# EAGLE design esp32 (EAGLE 7.5.0)
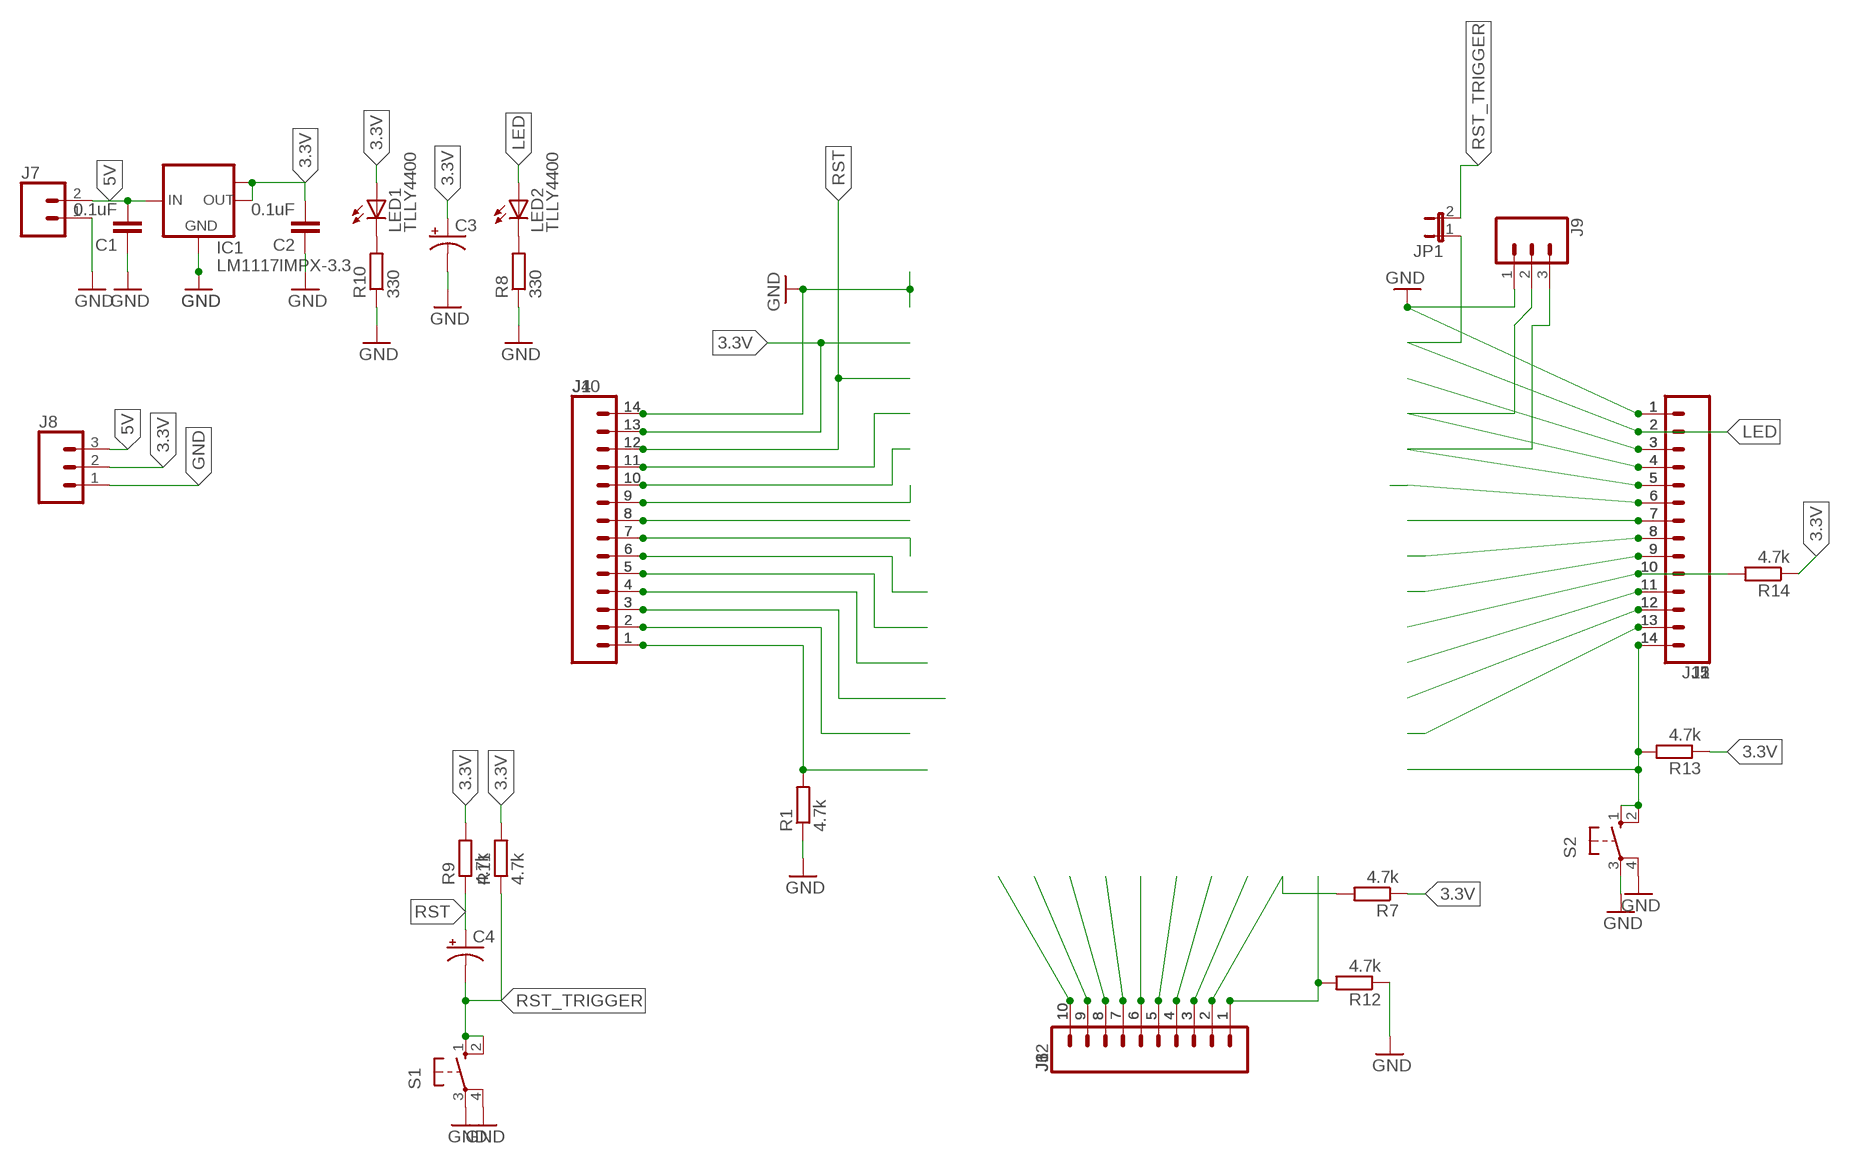
[diagram p0: schematic, sheet 1]

## Parts
C1  0.1uF  0.1UF-KIT-EZ-50V-20%  [CAP-PTH-SMALL-KIT]
C2  0.1uF  0.1UF-KIT-EZ-50V-20%  [CAP-PTH-SMALL-KIT]
C3  CPOL-USE3.5-8  [E3,5-8]
C4  CPOL-USE3.5-8  [E3,5-8]
IC1  LM1117IMPX-3.3  [SOT223]
J1  CONN_14LONGPADS  [1X14-LONGPADS]
J2  CONN_14LONGPADS  [1X14-LONGPADS]
J3  CONN_10"  [1X10]
J4  CONN_14LONGPADS  [1X14-LONGPADS]
J5  CONN_14LONGPADS  [1X14-LONGPADS]
J6  CONN_10"  [1X10]
J7  CONN_023.5MM  [SCREWTERMINAL-3.5MM-2]
J8  CONN_03  [1X03]
J9  CONN_03  [1X03]
J10  CONN_14LONGPADS  [1X14-LONGPADS]
J11  CONN_14LONGPADS  [1X14-LONGPADS]
J12  CONN_10"  [1X10]
JP1  JP1E  [JP1]
LED1  TLLY4400  [LED3MM]
LED2  TLLY4400  [LED3MM]
R1  4.7k  R-EU_0207/12  [0207/12]
R7  4.7k  R-EU_0207/12  [0207/12]
R8  330  R-EU_0207/12  [0207/12]
R9  4.7k  R-EU_0207/12  [0207/12]
R10  330  R-EU_0207/12  [0207/12]
R11  4.7k  R-EU_0207/12  [0207/12]
R12  4.7k  R-EU_0207/12  [0207/12]
R13  4.7k  R-EU_0207/12  [0207/12]
R14  4.7k  R-EU_0207/12  [0207/12]
S1  10-XX  [B3F-10XX]
S2  10-XX  [B3F-10XX]

## Nets
3.3V: C2.2 C3.+ IC1.2(OUT) IC1.TAB(OUT1) J1.13 J4.13 J8.2 J10.13 LED1.A R7.1 R9.2 R11.2 R13.1 R14.1
5V: C1.2 IC1.3(IN) J7.2 J8.3
GND: C1.1 C2.1 C3.- IC1.1(GND) J1.14 J2.1 J3.10 J4.14 J5.1 J6.10 J7.1 J8.1 J9.1 J10.14 J11.1 J12.10 R1.1 R8.1 R10.1 R12.1 S1.3(P) S1.4(P1) S2.3(P) S2.4(P1)
LED: J2.2 J5.2 J11.2 JP1.1 LED2.A
N$1: J2.7 J5.7 J11.7
N$2: J1.11 J4.11 J10.11
N$3: J1.10 J4.10 J10.10
N$4: LED1.K(C) R10.2
N$5: LED2.K(C) R8.2
N$6: J1.9 J4.9 J10.9
N$7: J1.8 J4.8 J10.8
N$8: J1.7 J4.7 J10.7
N$9: J1.6 J4.6 J10.6
N$10: J1.5 J4.5 J10.5
N$11: J1.4 J4.4 J10.4
N$12: J1.3 J4.3 J10.3
N$13: J1.2 J4.2 J10.2
N$14: J1.1 J4.1 J10.1 R1.2
N$15: J2.5 J5.5 J9.3 J11.5
N$16: J2.4 J5.4 J9.2 J11.4
N$17: J2.3 J5.3 J11.3
N$19: J2.10 J5.10 J11.10 R14.2
N$20: J2.6 J5.6 J11.6
N$22: J2.8 J5.8 J11.8
N$23: J2.9 J5.9 J11.9
N$25: J2.11 J5.11 J11.11
N$26: J2.12 J5.12 J11.12
N$27: J2.13 J5.13 J11.13
N$28: J2.14 J5.14 J11.14 R13.2 S2.1(S) S2.2(S1)
N$30: J3.9 J6.9 J12.9
N$31: J3.8 J6.8 J12.8
N$32: J3.7 J6.7 J12.7
N$33: J3.6 J6.6 J12.6
N$34: J3.5 J6.5 J12.5
N$35: J3.4 J6.4 J12.4
N$36: J3.3 J6.3 J12.3
N$37: J3.2 J6.2 J12.2 R7.2
N$38: J3.1 J6.1 J12.1 R12.2
RST: C4.+ J1.12 J4.12 J10.12 R9.1
RST_TRIGGER: C4.- JP1.2 R11.1 S1.1(S) S1.2(S1)

## Library data of the parts
C1 C2 = SparkFun-Capacitors:0.1UF: 0.1µF ceramic capacitors A capacitor is a passive two-terminal electrical component used to store electrical energy temporarily in an electric field.; PROD_ID: CAP-08370
C3 C4 = rcl:CPOL-US: POLARIZED CAPACITOR, American symbol
IC1 = lm1117:LM1117IMPX-*
J1 J2 J4 J5 J10 J11 = SparkFun-Connectors:CONN_14: Multi connection point. Often used as Generic Header-pin footprint for 0.1 inch spaced/style header connections On any of the 0.1 inch spaced packages, you can populate with these: Break Away Headers - Straight <https://www.sparkfun.com/products/116> (PRT-00116) Break Away Male Headers - Right Angle <https://www.sparkfun.com/products/553> (PRT-00553) Female Headers <https://www.sparkfun.com/products/115> (PRT-00115) Break Away Headers - Machine Pin <https://www.sparkfun.com/products/117> (PRT-00117) Break Away Female Headers - Swiss Machine Pin <https://www.sparkfun.com/products/743> (PRT-00743) For SCREWTERMINALS and SPRING TERMINALS visit here: Screw Terimnals on SparkFun.com <https://www.sparkfun.com/search/results?term=Screw+Terminals> (5mm/3.5mm/2.54mm spacing) This device is also useful as a general connection point to wire up your design to another part of your project. Our various solder wires solder well into these plated through hole pads. Hook-Up Wire - Assortment (Stranded, 22 AWG) <https://www.sparkfun.com/products/11375> (PRT-11375) Hook-Up Wire - Assortment (Solid Core, 22 AWG) <https://www.sparkfun.com/products/11367> (PRT-11367) View the entire wire category on our website here <https://www.sparkfun.com/categories/141> Special notes: Molex polarized connector foot print use with SKU : PRT-08231 with associated crimp pins and housings. 1MM SMD Version SKU: PRT-10208 NOTES ON THE VARIANTS LOCK and LOCK_LONGPADS... This footprint was designed to help hold the alignment of a through-hole component (i.e. 6-pin header) while soldering it into place. You may notice that each hole has been shifted either up or down by 0.005 of an inch from it's more standard position (which is a perfectly straight line). This slight alteration caused the pins (the squares in the middle) to touch the edges of the holes. Because they are alternating, it causes a "brace" to hold the component in place. 0.005 has proven to be the perfect amount of "off-center" position when using our standard breakaway headers. Although looks a little odd when you look at the bare footprint, once you have a header in there, the alteration is very hard to notice. Also,if you push a header all the way into place, it is covered up entirely on the bottom side.
J3 J6 J12 = SparkFun-Connectors:CONN_10: Multi connection point. Often used as Generic Header-pin footprint for 0.1 inch spaced/style header connections On any of the 0.1 inch spaced packages, you can populate with these: Break Away Headers - Straight <https://www.sparkfun.com/products/116> (PRT-00116) Break Away Male Headers - Right Angle <https://www.sparkfun.com/products/553> (PRT-00553) Female Headers <https://www.sparkfun.com/products/115> (PRT-00115) Break Away Headers - Machine Pin <https://www.sparkfun.com/products/117> (PRT-00117) Break Away Female Headers - Swiss Machine Pin <https://www.sparkfun.com/products/743> (PRT-00743) Arduino Stackable Header - 10 Pin <https://www.sparkfun.com/products/11376> (PRT-11376) For SCREWTERMINALS and SPRING TERMINALS visit here: Screw Terimnals on SparkFun.com <https://www.sparkfun.com/search/results?term=Screw+Terminals> (5mm/3.5mm/2.54mm spacing) This device is also useful as a general connection point to wire up your design to another part of your project. Our various solder wires solder well into these plated through hole pads. Hook-Up Wire - Assortment (Stranded, 22 AWG) <https://www.sparkfun.com/products/11375> (PRT-11375) Hook-Up Wire - Assortment (Solid Core, 22 AWG) <https://www.sparkfun.com/products/11367> (PRT-11367) View the entire wire category on our website here <https://www.sparkfun.com/categories/141> Special notes: Molex polarized connector foot print use with SKU : PRT-08231 with associated crimp pins and housings. 1MM SMD Version SKU: PRT-10208 NOTES ON THE VARIANTS LOCK and LOCK_LONGPADS... This footprint was designed to help hold the alignment of a through-hole component (i.e. 6-pin header) while soldering it into place. You may notice that each hole has been shifted either up or down by 0.005 of an inch from it's more standard position (which is a perfectly straight line). This slight alteration caused the pins (the squares in the middle) to touch the edges of the holes. Because they are alternating, it causes a "brace" to hold the component in place. 0.005 has proven to be the perfect amount of "off-center" position when using our standard breakaway headers. Although looks a little odd when you look at the bare footprint, once you have a header in there, the alteration is very hard to notice. Also,if you push a header all the way into place, it is covered up entirely on the bottom side.; PROD_ID: CONN-11563
J7 = SparkFun-Connectors:CONN_02: Multi connection point. Often used as Generic Header-pin footprint for 0.1 inch spaced/style header connections On any of the 0.1 inch spaced packages, you can populate with these: Break Away Headers - Straight <https://www.sparkfun.com/products/116> (PRT-00116) Break Away Male Headers - Right Angle <https://www.sparkfun.com/products/553> (PRT-00553) Female Headers <https://www.sparkfun.com/products/115> (PRT-00115) Break Away Headers - Machine Pin <https://www.sparkfun.com/products/117> (PRT-00117) Break Away Female Headers - Swiss Machine Pin <https://www.sparkfun.com/products/743> (PRT-00743) For SCREWTERMINALS and SPRING TERMINALS visit here: Screw Terimnals on SparkFun.com <https://www.sparkfun.com/search/results?term=Screw+Terminals> (5mm/3.5mm/2.54mm spacing) This device is also useful as a general connection point to wire up your design to another part of your project. Our various solder wires solder well into these plated through hole pads. Hook-Up Wire - Assortment (Stranded, 22 AWG) <https://www.sparkfun.com/products/11375> (PRT-11375) Hook-Up Wire - Assortment (Solid Core, 22 AWG) <https://www.sparkfun.com/products/11367> (PRT-11367) View the entire wire category on our website here <https://www.sparkfun.com/categories/141> Special notes: Molex polarized connector foot print use with: PRT-08233 with associated crimp pins and housings. 2.54_SCREWTERM for use with PRT-10571. 3.5mm Screw Terminal footprints for PRT-08084 5mm Screw Terminal footprints for use with PRT-08432; PROD_ID: CONN-08399
J8 J9 = SparkFun-Connectors:CONN_03: Multi connection point. Often used as Generic Header-pin footprint for 0.1 inch spaced/style header connections On any of the 0.1 inch spaced packages, you can populate with these: Break Away Headers - Straight <https://www.sparkfun.com/products/116> (PRT-00116) Break Away Male Headers - Right Angle <https://www.sparkfun.com/products/553> (PRT-00553) Female Headers <https://www.sparkfun.com/products/115> (PRT-00115) Break Away Headers - Machine Pin <https://www.sparkfun.com/products/117> (PRT-00117) Break Away Female Headers - Swiss Machine Pin <https://www.sparkfun.com/products/743> (PRT-00743) Stackable Header - 3 Pin (Female, 0.1") <https://www.sparkfun.com/products/13875> (PRT-13875) For SCREWTERMINALS and SPRING TERMINALS visit here: Screw Terimnals on SparkFun.com <https://www.sparkfun.com/search/results?term=Screw+Terminals> (5mm/3.5mm/2.54mm spacing) This device is also useful as a general connection point to wire up your design to another part of your project. Our various solder wires solder well into these plated through hole pads. Hook-Up Wire - Assortment (Stranded, 22 AWG) <https://www.sparkfun.com/products/11375> (PRT-11375) Hook-Up Wire - Assortment (Solid Core, 22 AWG) <https://www.sparkfun.com/products/11367> (PRT-11367) View the entire wire category on our website here <https://www.sparkfun.com/categories/141> Special notes: Molex polarized connector foot print use with SKU : PRT-08232 with associated crimp pins and housings.
JP1 = jumper:JP1E: JUMPER
LED1 LED2 = led:TLLY4400: Low Current (2mA) LED 3 mm Tinted Diffused Package color YELLOW Source: Data sheet <http://www.farnell.com/datasheets/391098.pdf>; MF: VISHAY SEMICONDUCTOR; OC_FARNELL: 1612439
R1 R7-R14 = rcl:R-EU_: RESISTOR, European symbol
S1 S2 = switch-omron:10-XX: OMRON SWITCH; MPN: B3F-1000; OC_FARNELL: 176432; OC_NEWARK: 36M3542

## Board
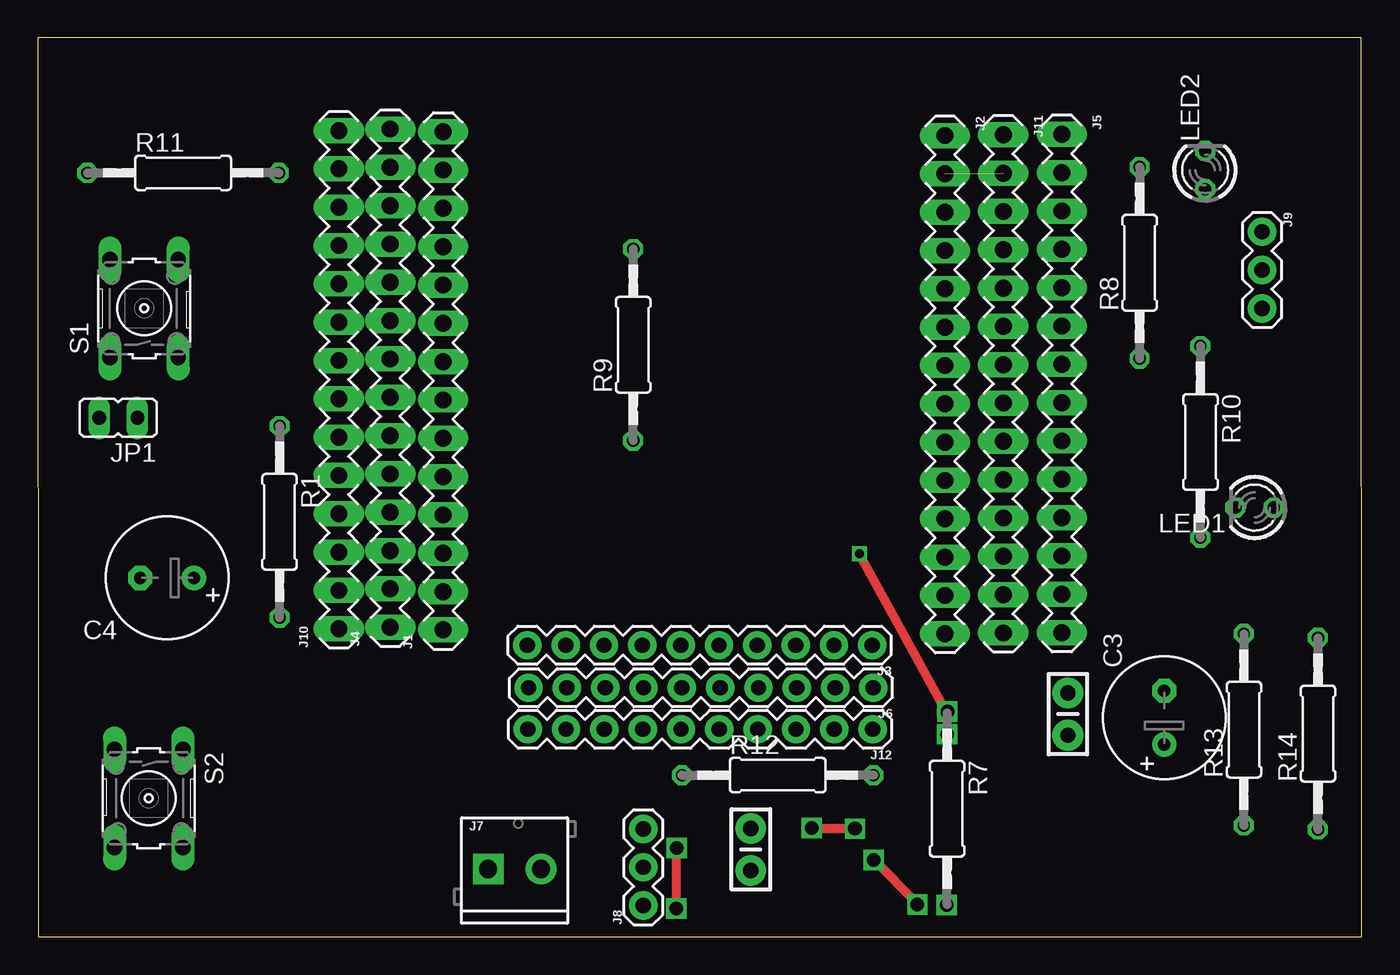
[diagram p1: board, top side]
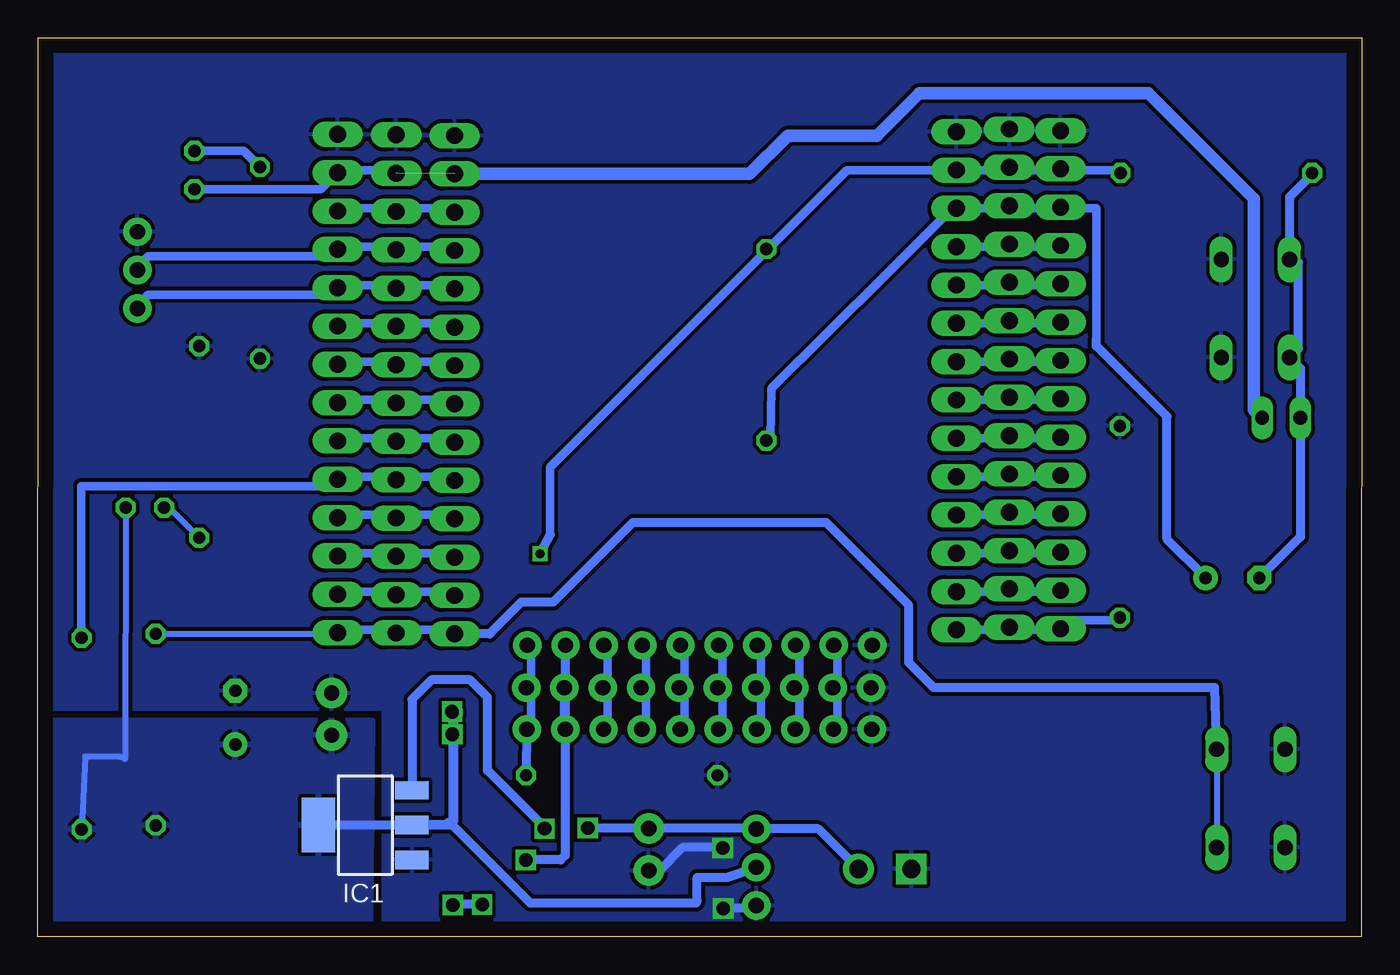
[diagram p2: board, bottom side, seen from below]

Size 87.79 x 59.6 mm. Coordinates in mm from the lower left corner, seen from the top.
Outline: 0.03,0 87.79,0 87.76,59.6 0,59.6 0.03,0
Copper layers (1*16): Top 0.035mm / dielectric 1.5mm / Bottom 0.035mm
Design rules "default *": minimum track width 22mil, minimum drill 24mil, track to track 10mil, track to pad 10mil, pad to pad 10mil, via to via 10mil, smd to smd 10mil, copper to edge 40mil, drill to drill 8mil, minimum pad ring 10mil, minimum via ring 8mil, stop-mask expansion 4mil, vias tented up to drill 0mil, thermal gap 10mil

### Footprints (pad centres in the part's own frame; a part is rotated, then mirrored left to right if it is on the bottom)
CAP-PTH-SMALL-KIT = drill 1.016 pad 2.032: 1 -1.397,0; 2 1.397,0
E3,5-8 = drill 0.813 pad 1.6: + -1.778,0 | drill 0.813 pad 1.6 octagon: - 1.778,0
SOT223 = smd 1.219 x 2.235: 1 -2.311,-3.099; 2 0,-3.099; 3 2.311,-3.099 | smd 3.6 x 2.2: TAB 0,3.099
1X14-LONGPADS = drill 1.118 long: 1 0,0; 2 2.54,0; 3 5.08,0; 4 7.62,0; 5 10.16,0; 6 12.7,0; 7 15.24,0; 8 17.78,0; 9 20.32,0; 10 22.86,0; 11 25.4,0; 12 27.94,0; 13 30.48,0; 14 33.02,0
1X10 = drill 1.016 pad 1.88: 1 0,0; 2 2.54,0; 3 5.08,0; 4 7.62,0; 5 10.16,0; 6 12.7,0; 7 15.24,0; 8 17.78,0; 9 20.32,0; 10 22.86,0
SCREWTERMINAL-3.5MM-2 = drill 1.2 pad 2.032 square: 1 0,0 | drill 1.2 pad 2.032: 2 3.5,0
1X03 = drill 1.016 pad 1.88: 1 0,0; 2 2.54,0; 3 5.08,0
JP1 = drill 0.914 long: 1 0,-1.27; 2 0,1.27
LED3MM = drill 0.813 octagon: A -1.27,0; K 1.27,0
0207/12 = drill 0.813 octagon: 1 -6.35,0; 2 6.35,0
B3F-10XX = drill 1.016 long: 1 -3.251,2.261; 2 3.251,2.261; 3 -3.251,-2.261; 4 3.251,-2.261

### Placement (x,y rotation side)
C1  47.28,5.79 90 top
C2  68.31,14.76 270 top
C3  74.69,14.53 90 top
C4  8.58,23.79 180 top
IC1  66.08,7.41 90 bottom
J1  26.88,20.35 90 top
J2  60.15,53.11 270 top
J3  55.33,19.33 180 top
J4  23.38,20.52 90 top
J5  67.9,53.19 270 top
J6  55.41,16.51 180 top
J7  29.87,4.5 0 top
J8  40.14,2.08 90 top
J9  81.19,46.74 270 top
J10  19.97,20.42 90 top
J11  64.02,53.16 270 top
J12  55.35,13.77 180 top
JP1  5.34,34.4 90 top
LED1  80.69,28.45 180 top
LED2  77.4,50.83 90 top
R1  16.04,27.51 270 top
R7  60.29,8.5 270 top
R8  73.06,44.68 90 top
R9  39.48,39.24 90 top
R10  77.09,32.81 270 top
R11  9.64,50.64 0 top
R12  49.07,10.72 0 top
R13  79.97,13.74 90 top
R14  84.88,13.47 90 top
S1  7.06,41.65 90 top
S2  7.36,9.18 270 top

### Tracks (layer width: path | path; a pad name or v marks a point on that pad's centre or on a via)
3.3V  (via drill 0.6)
  Top 0.61: R7.1 v54.47,25.39
  Bottom 0.406: LED1.A 82,11.8 82.4,11.94 84.66,11.94 R14.1 | R7.1 60.29,7.65 60.65,7.65
  Bottom 0.559: R11.2 16.34,50.83 19.51,50.83 J10.13 20.15,50.83 23.32,50.83 J4.13 23.96,50.83 J1.13 34.12,50.83 39.2,45.75 R9.2 39.83,45.11 53.8,31.14 53.8,26.7 53.79,26.67
  Bottom 0.61: R7.1 60.29,7.41 | 60.29,7.41 IC1.2 IC1.TAB | 60.29,7.41 55.14,2.26 44.13,2.26 44.07,2.42 44.07,3.94 42.08,3.94 J8.2 | v54.47,25.39 53.79,26.67
  pour Bottom: 65.57,14.33 89.09,14.33 89.09,-2.42 65.76,-2.42
5V  (via drill 0.6)
  Top 0.61: v51.34,7.2 v54.12,7.2
  Bottom 0.61: J7.2 36.02,7.16 J8.3 40.18,7.19 C1.2 v51.34,7.2 | v54.12,7.2 57.96,11.03 57.96,15.89 59.11,17.04 61.68,17.04 62.98,15.74 IC1.3
GND  (via drill 0.9)
  Top 0.61: v42.33,1.88 42.39,1.95 42.43,1.95 42.36,2.01 v42.36,5.89
  Bottom 0.61: J8.1 40.34,1.88 v42.33,1.88 | v42.36,5.89 42.4,5.93 45.03,5.93 46.57,4.4 C1.1
  pour Bottom: 64.62,-1.22 64.62,15.09 88.64,15.09 88.64,18.18 90.23,18.18 90.23,58.36 -0.99,58.36 -0.99,-4.06 64.6,-4.06
  pour Bottom: 64.86,2.1 64.86,18.41 88.88,18.41 88.88,21.51 90.46,21.51 90.46,65.72 -0.75,65.72 -0.75,-0.73 64.84,-0.73
LED  (1 unrouted)
  Bottom 0.559: LED2.A 69.04,49.56 68.41,50.19 J5.2 67.77,50.83 64.6,50.83 J11.2
  Bottom 0.813: JP1.1 7.16,34.95 7.16,48.92 14.17,55.93 29.34,55.93 32.16,53.11 38.06,53.11 40.6,50.57 J2.2
N$1
  Bottom 0.559: J2.7 60.15,38.13 63.96,38.13 J11.7 64.6,38.13 67.77,38.13 J5.7
N$2
  Bottom 0.559: J10.11 20.15,45.75 23.32,45.75 J4.11 23.96,45.75 J1.11
N$3
  Bottom 0.559: J10.10 20.15,43.21 23.32,43.21 J4.10 23.96,43.21 J1.10
N$4
  Bottom 0.406: LED1.K 79.09,28.45 R10.2
N$5
  Bottom 0.559: R8.2 74.12,52.1 LED2.K
N$6
  Bottom 0.559: J10.9 20.15,40.67 23.32,40.67 J4.9 23.96,40.67 J1.9
N$7
  Bottom 0.559: J10.8 20.15,38.13 23.32,38.13 J4.8 23.96,38.13 J1.8
N$8
  Bottom 0.559: J10.7 20.15,35.59 23.32,35.59 J4.7 23.96,35.59 J1.7
N$9
  Bottom 0.559: J10.6 20.15,33.05 23.32,33.05 J4.6 23.96,33.05 J1.6
N$10
  Bottom 0.559: J10.5 20.15,30.51 23.32,30.51 J4.5 23.96,30.51 J1.5
N$11
  Bottom 0.559: J10.4 20.15,27.97 23.32,27.97 J4.4 23.96,27.97 J1.4
N$12
  Bottom 0.559: J10.3 20.15,25.43 23.32,25.43 J4.3 23.96,25.43 J1.3
N$13
  Bottom 0.559: J10.2 20.15,22.89 23.32,22.89 J4.2 23.96,22.89 J1.2
N$14
  Bottom 0.559: R1.2 16.34,20.98 19.51,20.98 J10.1 20.15,20.35 23.32,20.35 J4.1 23.96,20.35 J1.1
N$15
  Bottom 0.559: J2.5 60.15,43.21 63.96,43.21 J11.5 64.6,43.21 67.77,43.21 J5.5 68.41,42.57 80.47,42.57 81.11,41.94 J9.3
N$16
  Bottom 0.559: J2.4 60.15,45.75 63.96,45.75 J11.4 64.6,45.75 67.77,45.75 J5.4 68.41,45.11 80.47,45.11 81.11,44.48 J9.2
N$17
  Bottom 0.559: J2.3 60.15,48.29 63.96,48.29 J11.3 64.6,48.29 67.77,48.29 J5.3
N$18  (via drill 0.9)
  other vias: 55.42,5.1
N$19
  Bottom 0.559: J2.10 60.15,30.51 63.96,30.51 J11.10 64.6,30.51 67.77,30.51 J5.10 68.41,29.87 84.92,29.87 84.92,20.35 R14.2
N$20
  Bottom 0.559: J2.6 60.15,40.67 63.96,40.67 J11.6 64.6,40.67 67.77,40.67 J5.6
N$21  (via drill 0.9)
  other vias: 58.32,2.15
N$22
  Bottom 0.559: J2.8 60.15,35.59 63.96,35.59 J11.8 64.6,35.59 67.77,35.59 J5.8
N$23
  Bottom 0.559: J2.9 60.15,33.05 63.96,33.05 J11.9 64.6,33.05 67.77,33.05 J5.9
N$24  (via drill 0.9)
  other vias: 54.19,7.17
N$25
  Bottom 0.559: J2.11 60.15,27.97 63.96,27.97 J11.11 64.6,27.97 67.77,27.97 J5.11
N$26
  Bottom 0.559: J2.12 60.15,25.43 63.96,25.43 J11.12 64.6,25.43 67.77,25.43 J5.12
N$27
  Bottom 0.559: J2.13 60.15,22.89 63.96,22.89 J11.13 64.6,22.89 67.77,22.89 J5.13
N$28
  Bottom 0.406: R13.2 67.98,20.09 J5.14 | S2.2 S2.1 9.76,15.61
  Bottom 0.559: J5.14 67.77,20.35 64.6,20.35 J11.14 63.96,20.35 60.15,20.35 J2.14
  Bottom 0.61: S2.1 9.76,16.52 28.38,16.52 30.03,18.17 30.03,21.97 35.51,27.45 48.35,27.45 53.62,22.18 55.73,22.18 57.83,20.09 J2.14
N$29  (via drill 0.9)
  other vias: 51.31,7.22
N$30
  Bottom 0.559: J12.9 34.75,14 34.75,15.9 J6.9 34.75,16.54 34.75,19.08 J3.9
N$31
  Bottom 0.559: J12.8 37.29,14 37.29,15.9 J6.8 37.29,16.54 37.29,19.08 J3.8
N$32
  Bottom 0.559: J12.7 39.83,14 39.83,15.9 J6.7 39.83,16.54 39.83,19.08 J3.7
N$33
  Bottom 0.559: J12.6 42.37,14 42.37,15.9 J6.6 42.37,16.54 42.37,19.08 J3.6
N$34
  Bottom 0.559: J12.5 44.91,14 44.91,15.9 J6.5 44.91,16.54 44.91,19.08 J3.5
N$35
  Bottom 0.559: J12.4 47.45,14 47.45,15.9 J6.4 47.45,16.54 47.45,19.08 J3.4
N$36
  Bottom 0.559: J12.3 49.99,14 49.99,15.9 J6.3 49.99,16.54 49.99,19.08 J3.3
N$37  (via drill 0.6)
  Top 0.61: v55.43,5.1 58.36,2.18 v58.36,2.15
  Bottom 0.61: 52.79,13.79 J12.2 52.81,5.41 53.11,5.1 v55.43,5.1 | 52.79,13.79 J3.2 | 52.79,13.79 52.86,13.87 J6.2 | v58.36,2.15 R7.2
N$38
  Bottom 0.559: J3.1 55.07,19.08 55.07,16.54 J6.1 55.07,15.9 55.07,14 J12.1
  Bottom 0.61: R12.2 55.35,12.79 J12.1
N$39  (via drill 0.9)
  other vias: 60.32,14.94
N$40  (via drill 0.9)
  other vias: 60.27,2.12
N$41  (via drill 0.9)
  other vias: 60.31,13.43
N$42
  Bottom 0.61: 60.34,14.75 60.23,14.75 60.23,7.64 60.29,7.64 60.29,7.42 63.13,7.42 63.13,7.53
RST
  Bottom 0.559: R9.1 39.2,33.05 39.13,36.35 31.58,43.84 27.13,48.29 J1.12 23.96,48.29 J4.12 23.32,48.29 20.15,48.29 J10.12 19.51,48.29 17.61,48.29 17.61,39.58 17.61,39.4
  Bottom 0.61: C4.+ 12.93,26.36 12.93,34.5 17.61,39.18 17.61,39.58
RST_TRIGGER
  Bottom 0.559: 3.64,50.19 R11.1
  Bottom 0.61: 3.64,50.19 4.8,49.03 S1.2 4.41,44.9 4.2,44.69 4.2,39 S1.1 4.07,37.68 JP1.2 4.07,26.52 C4.-